# Altium schematic sheet Power Supply.SchDoc
size A3; SheetNumber: 3; SheetTotal: 3; SPICEModelCachePMWPNHZN: <root> / <DocumentId>PMWPNHZN</DocumentId> / <CacheFrame Number="0"> / <Model Name="0805_885012107015_1uf" Kind="CKT"> / <Text>******* / .subckt 0805_885012107015_1uF 1 2 / Rser 1 3 0.00799934804354 / Lser 2 4 2.55135429E-10 / C1 3 4 0.000001 / Rpar 3 4 500000000 / .ends 0805_885012107015_1uF</Text> / </Model> / <Model Name="0805_885012207068_22nf" Kind="CKT"> / <Text>******* / .subckt 0805_885012207068_22nF 1 2 / Rser 1 3 0.0486328028818 / Lser 2 4 0.00000000041 / C1 3 4 0.000000022 / Rpar 3 4 10000000000 / .ends 0805_885012207068_22nF</Text> / </Model> / <Model Name="0805_885012207072_100nf" Kind="CKT"> / <Text>******* / .subckt 0805_885012207072_100nF 1 2 / Rser 1 3 0.0172819633028 / Lser 2 4 0.00000000035 / C1 3 4 0.0000001 / Rpar 3 4 5000000000 / .ends 0805_885012207072_100nF</Text> / </Model> / </CacheFrame> / </root>
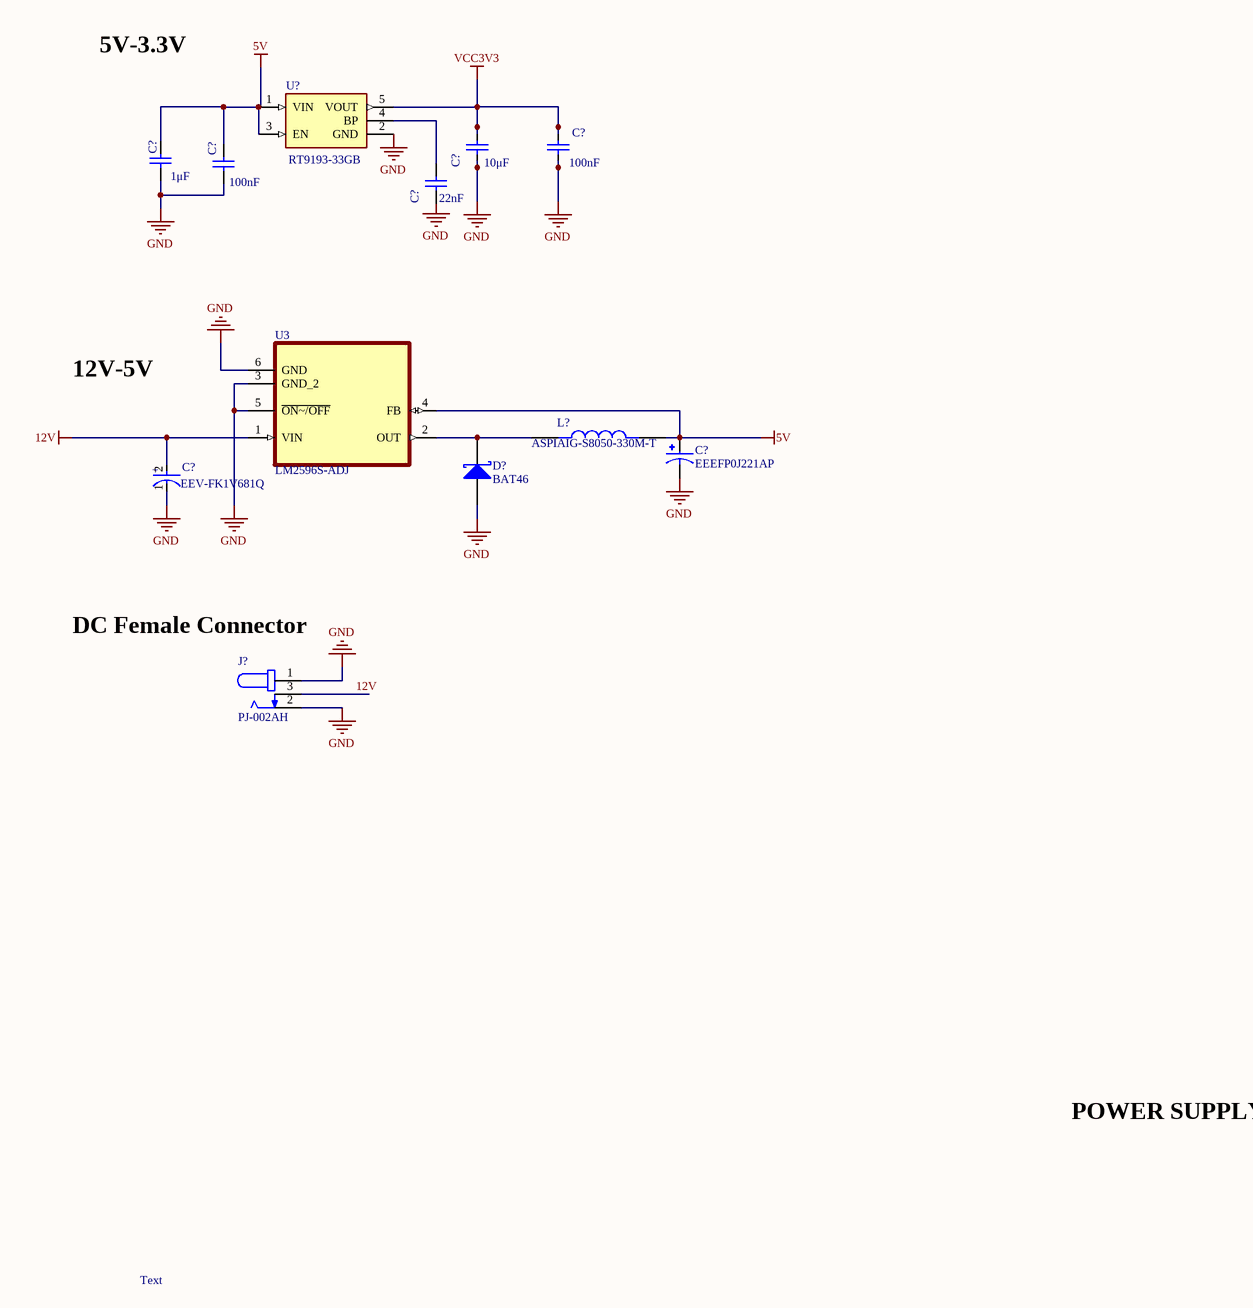
[diagram p0: Power Supply.SchDoc]

## Parts
(Parts that share a designator on the sheet are numbered #1, #2 ... from top to bottom, then left to right.)
C?#1  10μF  [WCAP-CSGP_0805_L2W1.25H1.25]
C?#2  100nF  [WCAP-CSGP_0805_L2W1.25H0.8_Reflow]
C?#3  1μF  [WCAP-CSGP_0805_L2W1.25H1.25]
C?#4  100nF  [WCAP-CSGP_0805_L2W1.25H0.8_Reflow]
C?#5  22nF  [WCAP-CSGP_0805_L2W1.25H0.8_Reflow]
C?#6  EEEFP0J221AP  [CAP_EEEFP0J221AP]
C?#7  EEV-FK1V681Q  [FP-FKH13-MFG]
D?  BAT46  [STM-DO-35-2]
J?  PJ-002AH  [CUI_PJ-002AH]
L?  ASPIAIG-S8050-330M-T  [IND_ASPIAIG-S8050-330M-T]
U3  LM2596S-ADJ  [TO170P1435X465-6N]
U?  RT9193-33GB  [SOT94P279X129-5N]

## Nets
5V: C?#3.2 C?#4.2 C?#6.1 L?.2 U3.4(FB) U?.1(VIN) U?.3(EN)
12V: C?#7.2(A) J?.3 U3.1(VIN)
GND: C?#1.1 C?#2.1 C?#3.1 C?#4.1 C?#6.2 C?#7.1(C) D?.1(A) J?.1 J?.2 U3.3(GND_2) U3.5(~{ON~/OFF}) U3.6(GND) U?.2(GND)
VCC3V3: C?#1.2 C?#2.2 U?.5(VOUT)
NetC?#5_2: C?#5.2 U?.4(BP)
NetD?_2: D?.2(K) L?.1 U3.2(OUT)

Not connected (* = marked no-connect by the designer): C?#5 1

## Notes on the sheet
- 5V-3.3V
- 12V-5V
- (near J?) DC Female Connector
- POWER SUPPLY
- Text
- Labels drawn without touching a wire or pin: GND
- (in symbol CMP-05427-002172-1) +

## Library data of the parts
C?#1 = 885012107027: WCAP-CSGP Multilayer Ceramic Chip Capacitor, General Purpose, size 0805, X5R Class II, 10μF, 25V; Manufacturer: Wurth Elektronik; Case/Size Code: 0805; Capacitance Tolerance: +/-10%; Dissipation Factor: 12.5%; Insulation Resistance: 0.005GΩ; Technical Reference: X5R0805106K025DFCT10000; Manufacturer Part Number: 885012107027; Category: Multilayer Ceramic Chip Capacitors; Match Code: WCAP-CSGP; ComponentLink1Description: Website Link; ComponentLink1URL: https://www.we-online.com/redexpert/article/885012107027?ad; ComponentLink2Description: Datasheet Link; ComponentLink2URL: https://www.we-online.com/redexpert/spec/885012107027?ad; Mount: Surface Mount; Min Operating Temperature: -55°C; Max Operating Temperature: 85°C; Packaging: Tape and Reel; Length: 2mm; Width: 1.25mm; Height: 1.25mm; Capacitance: 10μF; Ceramic Type: X5R Class II; Rated Voltage (DC): 25V
C?#2 C?#4 = 885012207072: WCAP-CSGP Multilayer Ceramic Chip Capacitor, General Purpose, size 0805, X7R, 100nF, 25V; Manufacturer: Wurth Elektronik; Case/Size Code: 0805; Capacitance Tolerance: +/-10%; Dissipation Factor: 3.5%; Insulation Resistance: 5GΩ; Technical Reference: X7R0805104K025DFCT10000; Manufacturer Part Number: 885012207072; Category: Multilayer Ceramic Chip Capacitors; Match Code: WCAP-CSGP; ComponentLink1Description: Website Link; ComponentLink1URL: https://www.we-online.com/redexpert/article/885012207072?ad; ComponentLink2Description: Datasheet Link; ComponentLink2URL: https://www.we-online.com/redexpert/spec/885012207072?ad; Mount: Surface Mount; Min Operating Temperature: -55°C; Max Operating Temperature: 125°C; Packaging: Tape and Reel; Length: 2mm; Width: 1.25mm; Height: 0.8mm; Capacitance: 100nF; Ceramic Type: X7R; Rated Voltage (DC): 25V
C?#3 = 885012107015: WCAP-CSGP Multilayer Ceramic Chip Capacitor, General Purpose, size 0805, X5R, 1μF, 25V; Manufacturer: Wurth Elektronik; Case/Size Code: 0805; Capacitance Tolerance: +/-20%; Dissipation Factor: 5%; Insulation Resistance: 0.5GΩ; Technical Reference: X5R0805105M025DFCT10000; Manufacturer Part Number: 885012107015; Category: Multilayer Ceramic Chip Capacitors; Match Code: WCAP-CSGP; ComponentLink1Description: Website Link; ComponentLink1URL: https://www.we-online.com/redexpert/article/885012107015?ad; ComponentLink2Description: Datasheet Link; ComponentLink2URL: https://www.we-online.com/redexpert/spec/885012107015?ad; Mount: Surface Mount; Min Operating Temperature: -55°C; Max Operating Temperature: 85°C; Packaging: Tape and Reel; Length: 2mm; Width: 1.25mm; Height: 1.25mm; Capacitance: 1μF; Ceramic Type: X5R; Rated Voltage (DC): 25V
C?#5 = 885012207068: WCAP-CSGP Multilayer Ceramic Chip Capacitor, General Purpose, size 0805, X7R, 22nF, 25V; Manufacturer: Wurth Elektronik; Case/Size Code: 0805; Capacitance Tolerance: +/-10%; Dissipation Factor: 3.5%; Insulation Resistance: 10GΩ; Technical Reference: X7R0805223K025DFCT10000; Manufacturer Part Number: 885012207068; Category: Multilayer Ceramic Chip Capacitors; Match Code: WCAP-CSGP; ComponentLink1Description: Website Link; ComponentLink1URL: https://www.we-online.com/redexpert/article/885012207068?ad; ComponentLink2Description: Datasheet Link; ComponentLink2URL: https://www.we-online.com/redexpert/spec/885012207068?ad; Mount: Surface Mount; Min Operating Temperature: -55°C; Max Operating Temperature: 125°C; Packaging: Tape and Reel; Length: 2mm; Width: 1.25mm; Height: 0.8mm; Capacitance: 22nF; Ceramic Type: X7R; Rated Voltage (DC): 25V
C?#6 = EEEFP0J221AP: CAP ALUM 220UF 20% 6.3V SMD; MF: Panasonic; SnapEDA_Link: https://www.snapeda.com/parts/EEEFP0J221AP/Panasonic/view-part/?ref=snap; Package: RADIAL-2 Panasonic; Value: *; MP: EEEFP0J221AP; Check_prices: https://www.snapeda.com/parts/EEEFP0J221AP/Panasonic/view-part/?ref=eda
C?#7 = CMP-05427-002172-1: CAP ALUM 680UF 20% 35V SMD; Ripple Current (AC): 1.1A; Life (Hours): 5000Hour; Material: Aluminium; ESR (Equivalent Series Resistance): 60mR; Leakage Current: 3uA; Max Operating Temperature: 105°C; Min Operating Temperature: -55°C; Reach SVHC Compliant: Yes; Radiation Hardening: No; Length: 14mm; Package Quantity: 200; Width: 900um; Mount: Surface Mount; Ripple Current: 1.1A; Lead Free: Lead Free; Case/Package: Radial; Voltage Rating (DC): 35V; Termination: SMD/SMT; Capacitance: 680uF; Series: FK; Packaging: Tape and Reel; Voltage: 35V; Height: 13.5mm; Construction: Cylindrical; Voltage Rating: 35V; Ratings: AEC-Q200; Contact Plating: Tin; Impedance: 60mR; Height - Seated (Max): 0.531inch; Diameter: 12.5mm; RoHS Compliant: Yes; Tolerance: 20%
D? = CMP-2000-05926-1: Small Signal Schottky Diode, 150 mA, 100 V, -65 to 125 degC, 2-Pin DO-35, RoHS, Tape and Reel; Manufacturer: STMicroelectronics; SVHC: NoSVHC(15-Jun-2015); Diode Configuration: Single; No. of Pins: 2Pins; Forward Surge Current Ifsm Max: 750mA; Repetitive Reverse Voltage Vrrm Max: 100V; Diode Case Style: DO-204AH; Forward Voltage VF Max: 1V; Forward Current If(AV): 150mA; Manufacturer URL: http://www.st.com/; Packaging: Tape&Reel; Package Reference: DO-35-2; Datasheet URL: http://www.st.com/content/ccc/resource/technical/document/datasheet/group1/11/76/e4/a3/df/07/49/14/CD00000767/files/CD00000767.pdf/jcr:content/translations/en.CD00000767.pdf; Diode Type: Schottky; Mounting Technology: ThroughHole; Package Description: 2-Pin Axial Lead, Dia 1.765 mm, Body Length 3.775 mm; Product Range: -; Datasheet Version: Rev. 2.1, 10/2001; Operating Temperature Max: 125°C
J? = PJ-002AH: 2.0 x 6.5 mm, 5.0 A, Horizontal, Through Hole, Dc Power Jack Connector; MF: Same Sky; SnapEDA_Link: https://www.snapeda.com/parts/PJ-002AH/Same+Sky/view-part/?ref=snap; Package: None; Value: *; MP: PJ-002AH; Check_prices: https://www.snapeda.com/parts/PJ-002AH/Same+Sky/view-part/?ref=eda
L? = ASPIAIG-S8050-330M-T: Inductor Power Shielded Wirewound 33uH 20% 100KHz Ferrite 2A 122mOhm DCR 3131 Automotive T/R; MF: Abracon LLC; MP: ASPIAIG-S8050-330M-T; SnapEDA_Link: https://www.snapeda.com/parts/ASPIAIG-S8050-330M-T/Abracon+LLC/view-part/?ref=snap; Value: *; Package: Nonstandard Abracon; Price: None; Availability: In Stock; Purchase-URL: https://pricing.snapeda.com/search/part/ASPIAIG-S8050-330M-T/?ref=eda; Check_prices: https://www.snapeda.com/parts/ASPIAIG-S8050-330M-T/Abracon+LLC/view-part/?ref=eda
U3 = LM2596S-ADJ: Buck Switching Regulator IC Positive Adjustable 1.2V 1 Output 3A TO-263-6, DÂ²Pak (5 Leads + Tab), TO-263BA; MF: UMW; SnapEDA_Link: https://www.snapeda.com/parts/LM2596S-ADJ/Umwelt+Sensor+Teknik/view-part/?ref=snap; Package: None; Value: *; MP: LM2596S-ADJ; Check_prices: https://www.snapeda.com/parts/LM2596S-ADJ/Umwelt+Sensor+Teknik/view-part/?ref=eda
U? = RT9193-33GB: Linear Voltage Regulator IC Positive Fixed 1 Output 300mA TSOT-23-5; MF: Richtek USA; SnapEDA_Link: https://www.snapeda.com/parts/RT9193-33GB/Richtek+USA+Inc./view-part/?ref=snap; Package: SOT-23-5 Richtek; MP: RT9193-33GB; Check_prices: https://www.snapeda.com/parts/RT9193-33GB/Richtek+USA+Inc./view-part/?ref=eda; Purchase-URL: https://pricing.snapeda.com/search/part/RT9193-33GB/?ref=eda; Digi-Key_Part_Number: 1028-1014-2-ND; Value: *